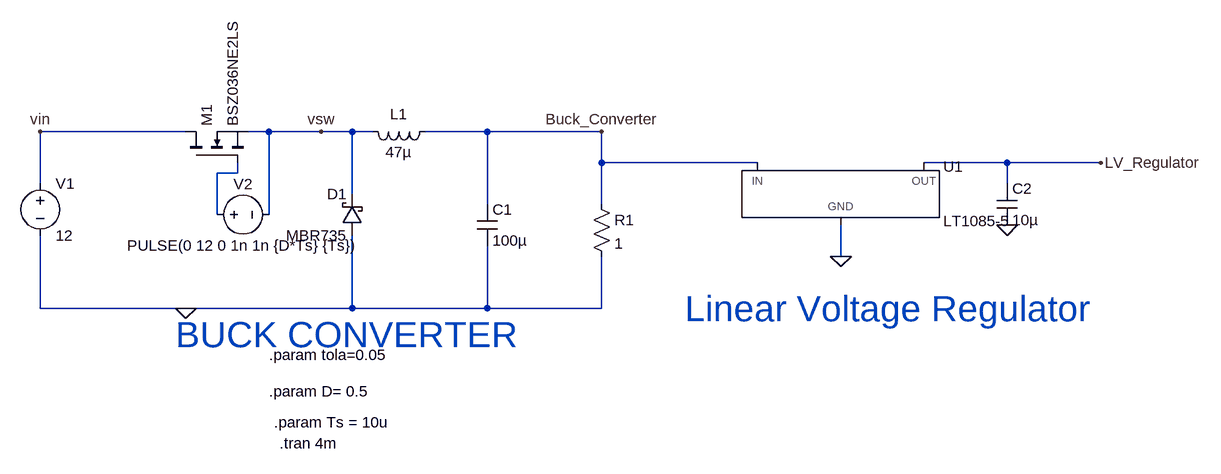
[diagram p0: schematic power_second.asc]
power_second.asc, the LTspice schematic file:
Version 4
SHEET 1 1712 680
WIRE -464 -96 -688 -96
WIRE -336 -96 -368 -96
WIRE -256 -96 -336 -96
WIRE -208 -96 -256 -96
WIRE -176 -96 -208 -96
WIRE 0 -96 -96 -96
WIRE 176 -96 0 -96
WIRE 176 -48 176 -96
WIRE 416 -48 176 -48
WIRE 800 -48 672 -48
WIRE 944 -48 800 -48
WIRE -384 -32 -384 -48
WIRE -384 -32 -416 -32
WIRE -688 -16 -688 -96
WIRE 800 -16 800 -48
WIRE -208 0 -208 -96
WIRE 0 16 0 -96
WIRE 176 16 176 -48
WIRE -416 32 -416 -32
WIRE -336 32 -336 -96
WIRE 544 96 544 48
WIRE -688 176 -688 64
WIRE -464 176 -688 176
WIRE -208 176 -208 64
WIRE -208 176 -464 176
WIRE 0 176 0 80
WIRE 0 176 -208 176
WIRE 176 176 176 96
WIRE 176 176 0 176
FLAG -464 176 0
FLAG 176 -96 Buck_Converter
FLAG -688 -96 vin
FLAG -256 -96 vsw
FLAG 544 96 0
FLAG 800 48 0
FLAG 944 -48 LV_Regulator
SYMBOL voltage -688 -32 R0
WINDOW 123 0 0 Left 0
WINDOW 39 0 0 Left 0
SYMATTR InstName V1
SYMATTR Value 12
SYMBOL nmos -464 -48 R270
SYMATTR InstName M1
SYMATTR Value BSZ036NE2LS
SYMBOL voltage -432 32 R270
WINDOW 0 32 56 VTop 2
WINDOW 3 -32 56 VBottom 2
WINDOW 123 0 0 Left 0
WINDOW 39 0 0 Left 0
SYMATTR InstName V2
SYMATTR Value PULSE(0 12 0 1n 1n {D*Ts} {Ts})
SYMBOL ind -80 -112 R90
WINDOW 0 5 56 VBottom 2
WINDOW 3 32 56 VTop 2
SYMATTR InstName L1
SYMATTR Value 47µ
SYMATTR SpiceLine Rser=10m
SYMBOL cap -16 16 R0
SYMATTR InstName C1
SYMATTR Value 100µ
SYMBOL res 160 0 R0
SYMATTR InstName R1
SYMATTR Value 1
SYMBOL schottky -192 64 R180
WINDOW 0 24 64 Left 2
WINDOW 3 24 0 Left 2
SYMATTR InstName D1
SYMATTR Value MBR735
SYMATTR Description Diode
SYMATTR Type diode
SYMBOL PowerProducts\\LT1085-5 544 -48 R0
SYMATTR InstName U1
SYMBOL cap 784 -16 R0
SYMATTR InstName C2
SYMATTR Value 10µ
TEXT -336 248 Left 2 !.param tola=0.05
TEXT -336 304 Left 2 !.param D= 0.5
TEXT -328 352 Left 2 !.param Ts = 10u
TEXT -320 384 Left 2 !.tran 4m
TEXT -480 216 Left 5 ;BUCK CONVERTER
TEXT 304 176 Left 5 ;Linear Voltage Regulator

The netlist it stands for:
* power_second.asc
V1 vin 0 12
M1 vin N001 vsw vsw BSZ036NE2LS
V2 N001 vsw PULSE(0 12 0 1n 1n {D*Ts} {Ts})
L1 Buck_Converter vsw 47µ Rser=10m
C1 Buck_Converter 0 100µ
R1 Buck_Converter 0 1
D1 0 vsw MBR735
XU1 0 LV_Regulator Buck_Converter LT1085-5  ; pins GND OUT IN
C2 LV_Regulator 0 10µ
.model D D
.lib standard.dio
.model NMOS NMOS
.model PMOS PMOS
.lib standard.mos
.param tola=0.05
.param D= 0.5
.param Ts = 10u
.tran 4m
* BUCK CONVERTER
* Linear Voltage Regulator
.backanno
.end